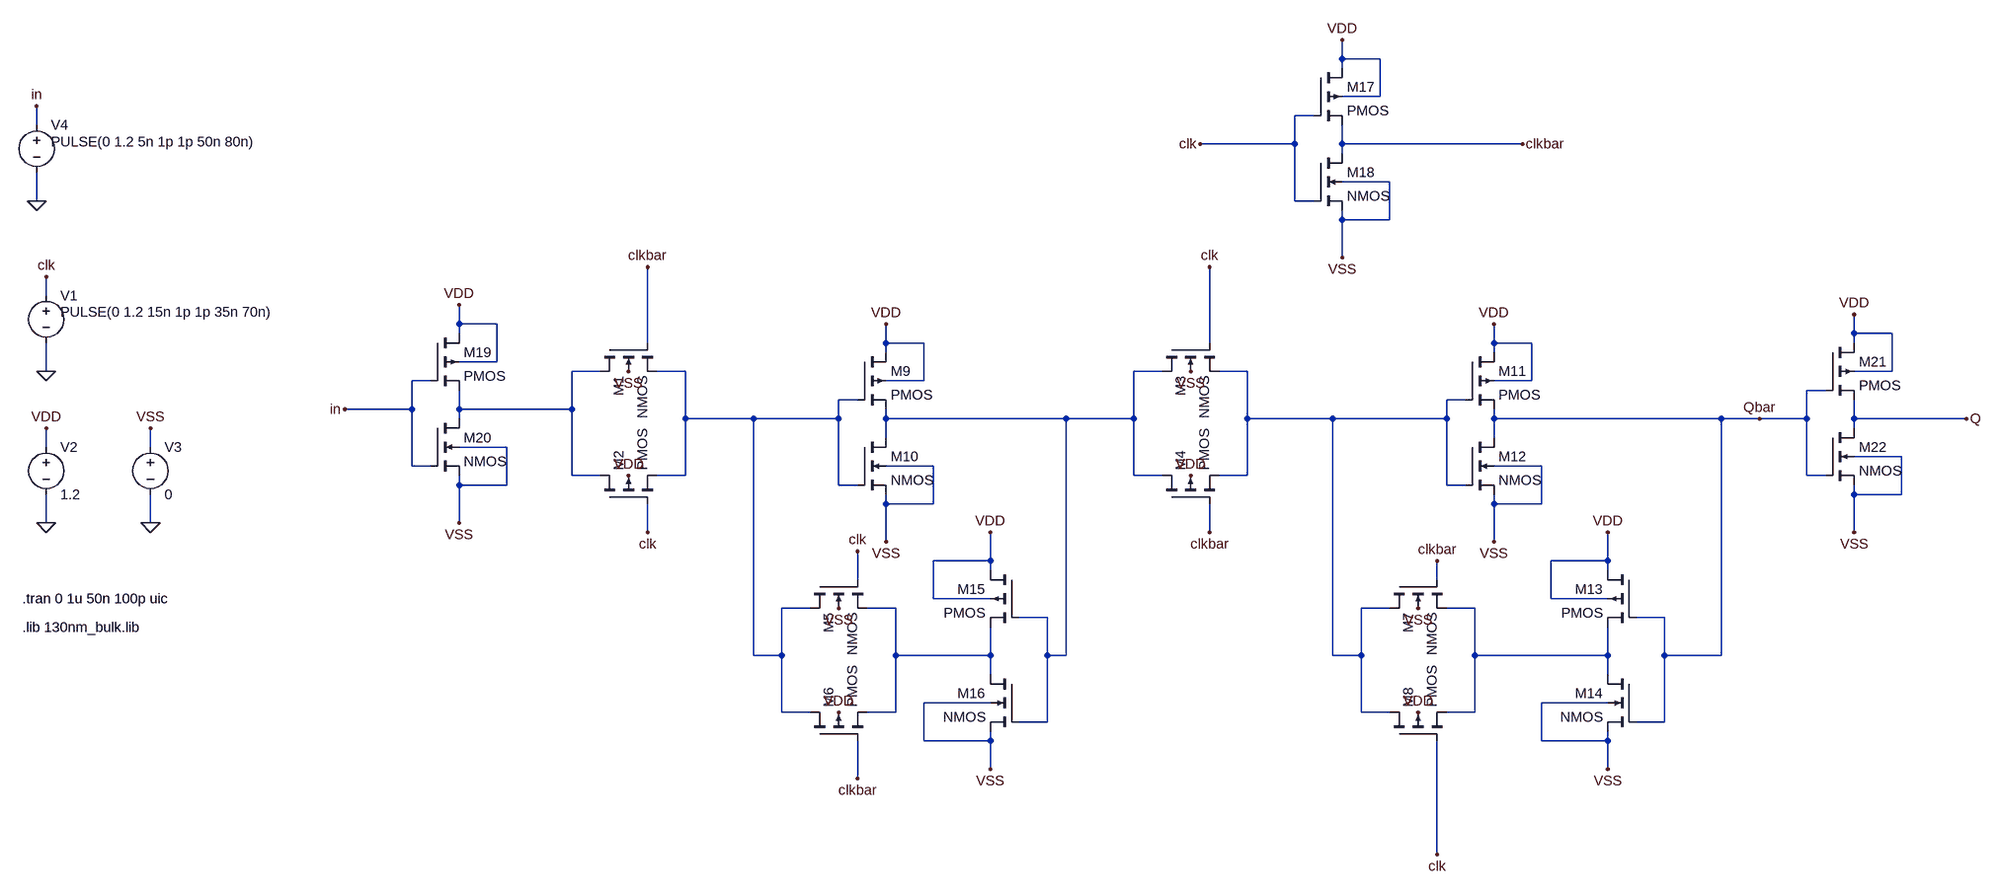
[diagram p0: schematic ffd_up.asc]
ffd_up.asc, the LTspice schematic file:
Version 4
SHEET 1 2772 1088
WIRE 1584 -672 1584 -704
WIRE 1648 -672 1584 -672
WIRE 1584 -656 1584 -672
WIRE 1648 -608 1648 -672
WIRE 1648 -608 1584 -608
WIRE 1536 -576 1504 -576
WIRE -928 -560 -928 -592
WIRE 1504 -528 1504 -576
WIRE 1504 -528 1344 -528
WIRE 1584 -528 1584 -560
WIRE 1888 -528 1584 -528
WIRE 1584 -512 1584 -528
WIRE 1664 -464 1584 -464
WIRE -928 -432 -928 -480
WIRE 1504 -432 1504 -528
WIRE 1536 -432 1504 -432
WIRE 1584 -400 1584 -416
WIRE 1664 -400 1664 -464
WIRE 1664 -400 1584 -400
WIRE 1584 -336 1584 -400
WIRE -912 -272 -912 -304
WIRE 0 -224 0 -256
WIRE 64 -224 0 -224
WIRE 0 -208 0 -224
WIRE 2448 -208 2448 -240
WIRE 2512 -208 2448 -208
WIRE 368 -192 368 -320
WIRE 784 -192 784 -224
WIRE 848 -192 784 -192
WIRE 1360 -192 1360 -320
WIRE 1840 -192 1840 -224
WIRE 1904 -192 1840 -192
WIRE 2448 -192 2448 -208
WIRE 784 -176 784 -192
WIRE 1840 -176 1840 -192
WIRE 64 -160 64 -224
WIRE 64 -160 0 -160
WIRE -912 -144 -912 -192
WIRE 288 -144 240 -144
WIRE 432 -144 384 -144
WIRE 1280 -144 1232 -144
WIRE 1424 -144 1376 -144
WIRE 2512 -144 2512 -208
WIRE 2512 -144 2448 -144
WIRE -48 -128 -80 -128
WIRE 848 -128 848 -192
WIRE 848 -128 784 -128
WIRE 1904 -128 1904 -192
WIRE 1904 -128 1840 -128
WIRE 2400 -112 2368 -112
WIRE 736 -96 704 -96
WIRE 1792 -96 1760 -96
WIRE -80 -80 -80 -128
WIRE -80 -80 -368 -80
WIRE 0 -80 0 -112
WIRE 240 -80 240 -144
WIRE 240 -80 0 -80
WIRE 0 -64 0 -80
WIRE 432 -64 432 -144
WIRE 560 -64 432 -64
WIRE 704 -64 704 -96
WIRE 704 -64 560 -64
WIRE 784 -64 784 -80
WIRE 1088 -64 784 -64
WIRE 1232 -64 1232 -144
WIRE 1232 -64 1088 -64
WIRE 1424 -64 1424 -144
WIRE 1568 -64 1424 -64
WIRE 1760 -64 1760 -96
WIRE 1760 -64 1568 -64
WIRE 1840 -64 1840 -80
WIRE 2224 -64 1840 -64
WIRE 2288 -64 2224 -64
WIRE 2368 -64 2368 -112
WIRE 2368 -64 2288 -64
WIRE 2448 -64 2448 -96
WIRE 2736 -64 2448 -64
WIRE 2448 -48 2448 -64
WIRE 784 -32 784 -64
WIRE 1840 -32 1840 -64
WIRE -912 -16 -912 -48
WIRE -736 -16 -736 -48
WIRE 80 -16 0 -16
WIRE 2528 0 2448 0
WIRE -80 16 -80 -80
WIRE -48 16 -80 16
WIRE 864 16 784 16
WIRE 1920 16 1840 16
WIRE 240 32 240 -80
WIRE 288 32 240 32
WIRE 432 32 432 -64
WIRE 432 32 384 32
WIRE 1232 32 1232 -64
WIRE 1280 32 1232 32
WIRE 1424 32 1424 -64
WIRE 1424 32 1376 32
WIRE 2368 32 2368 -64
WIRE 2400 32 2368 32
WIRE 0 48 0 32
WIRE 80 48 80 -16
WIRE 80 48 0 48
WIRE 704 48 704 -64
WIRE 736 48 704 48
WIRE 1760 48 1760 -64
WIRE 1792 48 1760 48
WIRE 2448 64 2448 48
WIRE 2528 64 2528 0
WIRE 2528 64 2448 64
WIRE 784 80 784 64
WIRE 864 80 864 16
WIRE 864 80 784 80
WIRE 1840 80 1840 64
WIRE 1920 80 1920 16
WIRE 1920 80 1840 80
WIRE -912 112 -912 64
WIRE -736 112 -736 64
WIRE 0 112 0 48
WIRE 368 128 368 80
WIRE 1360 128 1360 80
WIRE 2448 128 2448 64
WIRE 784 144 784 80
WIRE 1840 144 1840 80
WIRE 960 176 960 128
WIRE 960 176 864 176
WIRE 2032 176 2032 128
WIRE 2032 176 1936 176
WIRE 960 192 960 176
WIRE 2032 192 2032 176
WIRE 736 208 736 160
WIRE 1744 208 1744 176
WIRE 864 240 864 176
WIRE 960 240 864 240
WIRE 1936 240 1936 176
WIRE 2032 240 1936 240
WIRE 656 256 608 256
WIRE 800 256 752 256
WIRE 1664 256 1616 256
WIRE 1808 256 1760 256
WIRE 1056 272 1008 272
WIRE 2128 272 2080 272
WIRE 560 336 560 -64
WIRE 608 336 608 256
WIRE 608 336 560 336
WIRE 800 336 800 256
WIRE 960 336 960 288
WIRE 960 336 800 336
WIRE 1056 336 1056 272
WIRE 1088 336 1088 -64
WIRE 1088 336 1056 336
WIRE 1568 336 1568 -64
WIRE 1616 336 1616 256
WIRE 1616 336 1568 336
WIRE 1808 336 1808 256
WIRE 2032 336 2032 288
WIRE 2032 336 1808 336
WIRE 2128 336 2128 272
WIRE 2224 336 2224 -64
WIRE 2224 336 2128 336
WIRE 960 368 960 336
WIRE 2032 368 2032 336
WIRE 960 416 848 416
WIRE 2032 416 1920 416
WIRE 608 432 608 336
WIRE 656 432 608 432
WIRE 800 432 800 336
WIRE 800 432 752 432
WIRE 1616 432 1616 336
WIRE 1664 432 1616 432
WIRE 1808 432 1808 336
WIRE 1808 432 1760 432
WIRE 1056 448 1056 336
WIRE 1056 448 1008 448
WIRE 2128 448 2128 336
WIRE 2128 448 2080 448
WIRE 848 480 848 416
WIRE 960 480 960 464
WIRE 960 480 848 480
WIRE 1920 480 1920 416
WIRE 2032 480 2032 464
WIRE 2032 480 1920 480
WIRE 960 528 960 480
WIRE 2032 528 2032 480
WIRE 736 544 736 480
WIRE 1744 672 1744 480
FLAG 1744 672 clk
FLAG 2736 -64 Q
FLAG -368 -80 in
FLAG 1360 -320 clk
FLAG 704 432 VDD
FLAG 1328 32 VDD
FLAG 1712 432 VDD
FLAG 736 160 clk
FLAG 736 544 clkbar
FLAG 1360 128 clkbar
FLAG 1744 176 clkbar
FLAG 2288 -64 Qbar
FLAG 784 -224 VDD
FLAG 2032 128 VDD
FLAG 960 128 VDD
FLAG 1840 -224 VDD
FLAG 1584 -704 VDD
FLAG 1344 -528 clk
FLAG 1888 -528 clkbar
FLAG 784 144 VSS
FLAG 704 256 VSS
FLAG 960 528 VSS
FLAG 1328 -144 VSS
FLAG 1584 -336 VSS
FLAG 1840 144 VSS
FLAG 1712 256 VSS
FLAG 2032 528 VSS
FLAG 368 128 clk
FLAG 336 32 VDD
FLAG 368 -320 clkbar
FLAG 336 -144 VSS
FLAG 0 -256 VDD
FLAG 0 112 VSS
FLAG 2448 -240 VDD
FLAG 2448 128 VSS
FLAG -912 -144 0
FLAG -912 -304 clk
FLAG -928 -592 in
FLAG -912 -48 VDD
FLAG -912 112 0
FLAG -736 -48 VSS
FLAG -736 112 0
FLAG -928 -432 0
SYMBOL nmos4 1280 -192 M90
SYMATTR InstName M3
SYMATTR Value2 l=0.13u w=0.15u
SYMBOL pmos4 1280 80 R270
SYMATTR InstName M4
SYMATTR Value2 l=0.13u w=0.3u
SYMBOL nmos4 656 208 M90
SYMATTR InstName M5
SYMATTR Value2 l=0.13u w=0.15u
SYMBOL pmos4 656 480 R270
SYMATTR InstName M6
SYMATTR Value2 l=0.13u w=0.3u
SYMBOL nmos4 1664 208 M90
SYMATTR InstName M7
SYMATTR Value2 l=0.13u w=0.15u
SYMBOL pmos4 1664 480 R270
SYMATTR InstName M8
SYMATTR Value2 l=0.13u w=0.3u
SYMBOL pmos4 736 -176 R0
SYMATTR InstName M9
SYMATTR Value2 l=0.13u w=0.3u
SYMBOL nmos4 736 -32 R0
SYMATTR InstName M10
SYMATTR Value2 l=0.13u w=0.15u
SYMBOL pmos4 2080 192 M0
SYMATTR InstName M13
SYMATTR Value2 l=0.13u w=0.3u
SYMBOL nmos4 2080 368 M0
SYMATTR InstName M14
SYMATTR Value2 l=0.13u w=0.15u
SYMBOL pmos4 1008 192 M0
SYMATTR InstName M15
SYMATTR Value2 l=0.13u w=0.3u
SYMBOL nmos4 1008 368 M0
SYMATTR InstName M16
SYMATTR Value2 l=0.13u w=0.15u
SYMBOL pmos4 1792 -176 R0
SYMATTR InstName M11
SYMATTR Value2 l=0.13u w=0.3u
SYMBOL nmos4 1792 -32 R0
SYMATTR InstName M12
SYMATTR Value2 l=0.13u w=0.15u
SYMBOL pmos4 1536 -656 R0
SYMATTR InstName M17
SYMATTR Value2 l=0.13u w=0.3u
SYMBOL nmos4 1536 -512 R0
SYMATTR InstName M18
SYMATTR Value2 l=0.13u w=0.15u
SYMBOL nmos4 288 -192 M90
SYMATTR InstName M1
SYMATTR Value2 l=0.13u w=0.15u
SYMBOL pmos4 288 80 R270
SYMATTR InstName M2
SYMATTR Value2 l=0.13u w=0.3u
SYMBOL pmos4 -48 -208 R0
SYMATTR InstName M19
SYMATTR Value2 l=0.13u w=0.3u
SYMBOL nmos4 -48 -64 R0
SYMATTR InstName M20
SYMATTR Value2 l=0.13u w=0.15u
SYMBOL pmos4 2400 -192 R0
SYMATTR InstName M21
SYMATTR Value2 l=0.13u w=0.3u
SYMBOL nmos4 2400 -48 R0
SYMATTR InstName M22
SYMATTR Value2 l=0.13u w=0.15u
SYMBOL voltage -912 -288 R0
WINDOW 3 24 44 Left 2
WINDOW 123 0 0 Left 0
WINDOW 39 0 0 Left 0
SYMATTR Value PULSE(0 1.2 15n 1p 1p 35n 70n)
SYMATTR InstName V1
SYMBOL voltage -912 -32 R0
WINDOW 123 0 0 Left 0
WINDOW 39 0 0 Left 0
SYMATTR InstName V2
SYMATTR Value 1.2
SYMBOL voltage -736 -32 R0
WINDOW 123 0 0 Left 0
WINDOW 39 0 0 Left 0
SYMATTR InstName V3
SYMATTR Value 0
SYMBOL voltage -928 -576 R0
WINDOW 3 24 44 Left 2
WINDOW 123 0 0 Left 0
WINDOW 39 0 0 Left 0
SYMATTR Value PULSE(0 1.2 5n 1p 1p 50n 80n)
SYMATTR InstName V4
TEXT -952 240 Left 2 !.tran 0 1u 50n 100p uic
TEXT -952 288 Left 2 !.lib 130nm_bulk.lib

The netlist it stands for:
* ffd_up.asc
M3 N003 clk N004 VSS NMOS l=0.13u w=0.15u
M4 N003 clkbar N004 VDD PMOS l=0.13u w=0.3u
M5 N002 clk N005 VSS NMOS l=0.13u w=0.15u
M6 N002 clkbar N005 VDD PMOS l=0.13u w=0.3u
M7 N004 clkbar N006 VSS NMOS l=0.13u w=0.15u
M8 N004 clk N006 VDD PMOS l=0.13u w=0.3u
M9 VDD N002 N003 VDD PMOS l=0.13u w=0.3u
M10 N003 N002 VSS VSS NMOS l=0.13u w=0.15u
M13 VDD Qbar N006 VDD PMOS l=0.13u w=0.3u
M14 N006 Qbar VSS VSS NMOS l=0.13u w=0.15u
M15 VDD N003 N005 VDD PMOS l=0.13u w=0.3u
M16 N005 N003 VSS VSS NMOS l=0.13u w=0.15u
M11 VDD N004 Qbar VDD PMOS l=0.13u w=0.3u
M12 Qbar N004 VSS VSS NMOS l=0.13u w=0.15u
M17 VDD clk clkbar VDD PMOS l=0.13u w=0.3u
M18 clkbar clk VSS VSS NMOS l=0.13u w=0.15u
M1 N001 clkbar N002 VSS NMOS l=0.13u w=0.15u
M2 N001 clk N002 VDD PMOS l=0.13u w=0.3u
M19 VDD in N001 VDD PMOS l=0.13u w=0.3u
M20 N001 in VSS VSS NMOS l=0.13u w=0.15u
M21 VDD Qbar Q VDD PMOS l=0.13u w=0.3u
M22 Q Qbar VSS VSS NMOS l=0.13u w=0.15u
V1 clk 0 PULSE(0 1.2 15n 1p 1p 35n 70n)
V2 VDD 0 1.2
V3 VSS 0 0
V4 in 0 PULSE(0 1.2 5n 1p 1p 50n 80n)
.model NMOS NMOS
.model PMOS PMOS
.lib standard.mos
.tran 0 1u 50n 100p uic
.lib 130nm_bulk.lib
.backanno
.end